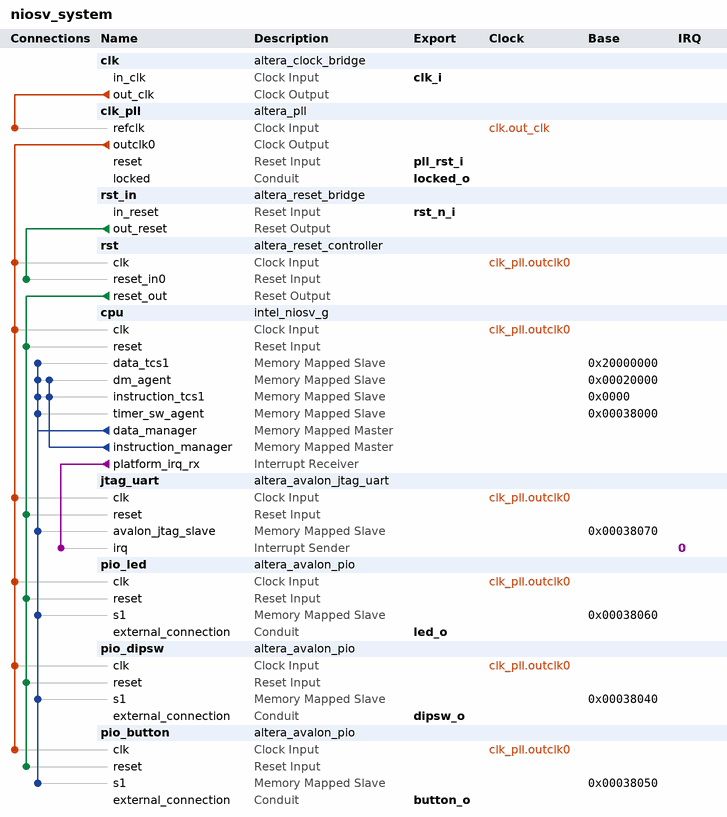
[diagram p0: system contents]
# Platform Designer (Qsys) system niosv_system, Cyclone V 5CSEMA6U23I7
# Parameters at their usual value, and those the tool derives, are not listed.
package require -exact qsys 25.1
create_system niosv_system
set_project_property DEVICE_FAMILY {Cyclone V}
set_project_property DEVICE 5CSEMA6U23I7

add_instance clk altera_clock_bridge 25.1
set_instance_parameter_value clk DERIVED_CLOCK_RATE 0
set_instance_parameter_value clk EXPLICIT_CLOCK_RATE 50000000

add_instance clk_pll altera_pll 25.1
set_instance_parameter_value clk_pll gui_device_speed_grade 1
set_instance_parameter_value clk_pll gui_number_of_clocks 1
set_instance_parameter_value clk_pll gui_operation_mode direct
set_instance_parameter_value clk_pll gui_output_clock_frequency0 100.0
set_instance_parameter_value clk_pll gui_pll_mode {Integer-N PLL}
set_instance_parameter_value clk_pll gui_reference_clock_frequency 50.0
set_instance_parameter_value clk_pll gui_use_locked true

add_instance rst_in altera_reset_bridge 25.1
set_instance_parameter_value rst_in ACTIVE_LOW_RESET 1
set_instance_parameter_value rst_in SYNCHRONOUS_EDGES none

add_instance rst altera_reset_controller 25.1
set_instance_parameter_value rst NUM_RESET_INPUTS 1
set_instance_parameter_value rst SYNC_DEPTH 2

add_instance cpu intel_niosv_g 4.0.0
set_instance_parameter_value cpu Blind_Window_Period 1000
set_instance_parameter_value cpu CLICenabledInterruptMode 0
set_instance_parameter_value cpu CLICenabledShadowRegisterFiles 1
set_instance_parameter_value cpu Default_Timeout_Period 255
set_instance_parameter_value cpu alignCLICVectorTable 8
set_instance_parameter_value cpu basicInterruptMode 0
set_instance_parameter_value cpu basicShadowRegisterFiles 0
set_instance_parameter_value cpu clockFrequency 100000000
set_instance_parameter_value cpu dataCacheSize 0
set_instance_parameter_value cpu disableFsqrtFdiv false
set_instance_parameter_value cpu dtcm1Base 536870912
set_instance_parameter_value cpu dtcm1InitFile ../software/build/firmware/niosvdtcm1.hex
set_instance_parameter_value cpu dtcm1Size 32768
set_instance_parameter_value cpu dtcm2Base 0
set_instance_parameter_value cpu dtcm2Size 0
set_instance_parameter_value cpu enableBranchPrediction true
set_instance_parameter_value cpu enableCLICInterruptEdgeTriggerConfig false
set_instance_parameter_value cpu enableCLICInterruptPolarityConfig false
set_instance_parameter_value cpu enableCLICSelectiveHardwareVectoring false
set_instance_parameter_value cpu enableCoreLevelInterruptController false
set_instance_parameter_value cpu enableDebug true
set_instance_parameter_value cpu enableDebugReset false
set_instance_parameter_value cpu enableECCFull false
set_instance_parameter_value cpu enableECCLite false
set_instance_parameter_value cpu enableFPU false
set_instance_parameter_value cpu enableLockstep false
set_instance_parameter_value cpu enableLockstepExtRst false
set_instance_parameter_value cpu enableMulDiv true
set_instance_parameter_value cpu hartId 0
set_instance_parameter_value cpu instCacheSize 0
set_instance_parameter_value cpu itcm1Base 0
set_instance_parameter_value cpu itcm1InitFile ../software/build/firmware/niosvitcm1.hex
set_instance_parameter_value cpu itcm1Size 131072
set_instance_parameter_value cpu itcm2Base 0
set_instance_parameter_value cpu itcm2Size 0
set_instance_parameter_value cpu numCLICDebugTriggers 0
set_instance_parameter_value cpu numCLICLevels 2
set_instance_parameter_value cpu numCLICPlatformInterrupts 16
set_instance_parameter_value cpu numCLICPriorities 8
set_instance_parameter_value cpu peripheralRegionABase 0
set_instance_parameter_value cpu peripheralRegionASize 0
set_instance_parameter_value cpu peripheralRegionBBase 0
set_instance_parameter_value cpu peripheralRegionBSize 0
set_instance_parameter_value cpu resetOffset 0
set_instance_parameter_value cpu resetSlave Absolute
set_instance_parameter_value cpu useResetReq false

add_instance jtag_uart altera_avalon_jtag_uart 25.1
set_instance_parameter_value jtag_uart readBufferDepth 1024
set_instance_parameter_value jtag_uart simInteractiveOptions NO_INTERACTIVE_WINDOWS
set_instance_parameter_value jtag_uart writeBufferDepth 1024

add_instance pio_led altera_avalon_pio 25.1
set_instance_parameter_value pio_led direction Output
set_instance_parameter_value pio_led width 1

add_instance pio_dipsw altera_avalon_pio 25.1
set_instance_parameter_value pio_dipsw direction Input
set_instance_parameter_value pio_dipsw width 4

add_instance pio_button altera_avalon_pio 25.1
set_instance_parameter_value pio_button direction Input
set_instance_parameter_value pio_button width 2

# connections
add_connection clk.out_clk clk_pll.refclk clock
add_connection clk_pll.outclk0 cpu.clk clock
add_connection clk_pll.outclk0 jtag_uart.clk clock
add_connection clk_pll.outclk0 pio_button.clk clock
add_connection clk_pll.outclk0 pio_dipsw.clk clock
add_connection clk_pll.outclk0 pio_led.clk clock
add_connection clk_pll.outclk0 rst.clk clock
add_connection rst.reset_out cpu.reset reset
add_connection rst.reset_out jtag_uart.reset reset
add_connection rst.reset_out pio_button.reset reset
add_connection rst.reset_out pio_dipsw.reset reset
add_connection rst.reset_out pio_led.reset reset
add_connection rst_in.out_reset rst.reset_in0 reset
add_connection cpu.data_manager cpu.data_tcs1 avalon
set_connection_parameter_value cpu.data_manager/cpu.data_tcs1 baseAddress 0x20000000
add_connection cpu.data_manager cpu.dm_agent avalon
set_connection_parameter_value cpu.data_manager/cpu.dm_agent baseAddress 0x00020000
add_connection cpu.data_manager cpu.instruction_tcs1 avalon
set_connection_parameter_value cpu.data_manager/cpu.instruction_tcs1 baseAddress 0x0000
add_connection cpu.data_manager cpu.timer_sw_agent avalon
set_connection_parameter_value cpu.data_manager/cpu.timer_sw_agent baseAddress 0x00038000
add_connection cpu.data_manager jtag_uart.avalon_jtag_slave avalon
set_connection_parameter_value cpu.data_manager/jtag_uart.avalon_jtag_slave baseAddress 0x00038070
add_connection cpu.data_manager pio_button.s1 avalon
set_connection_parameter_value cpu.data_manager/pio_button.s1 baseAddress 0x00038050
add_connection cpu.data_manager pio_dipsw.s1 avalon
set_connection_parameter_value cpu.data_manager/pio_dipsw.s1 baseAddress 0x00038040
add_connection cpu.data_manager pio_led.s1 avalon
set_connection_parameter_value cpu.data_manager/pio_led.s1 baseAddress 0x00038060
add_connection cpu.instruction_manager cpu.dm_agent avalon
set_connection_parameter_value cpu.instruction_manager/cpu.dm_agent baseAddress 0x00020000
add_connection cpu.instruction_manager cpu.instruction_tcs1 avalon
set_connection_parameter_value cpu.instruction_manager/cpu.instruction_tcs1 baseAddress 0x0000
add_connection cpu.platform_irq_rx jtag_uart.irq interrupt
set_connection_parameter_value cpu.platform_irq_rx/jtag_uart.irq irqNumber 0

# exported interfaces
add_interface button_o conduit end
set_interface_property button_o EXPORT_OF pio_button.external_connection
add_interface clk_i clock sink
set_interface_property clk_i EXPORT_OF clk.in_clk
add_interface dipsw_o conduit end
set_interface_property dipsw_o EXPORT_OF pio_dipsw.external_connection
add_interface led_o conduit end
set_interface_property led_o EXPORT_OF pio_led.external_connection
add_interface locked_o conduit end
set_interface_property locked_o EXPORT_OF clk_pll.locked
add_interface pll_rst_i reset sink
set_interface_property pll_rst_i EXPORT_OF clk_pll.reset
add_interface rst_n_i reset sink
set_interface_property rst_n_i EXPORT_OF rst_in.in_reset

set_interconnect_requirement {$system} qsys_mm.clockCrossingAdapter HANDSHAKE
set_interconnect_requirement {$system} qsys_mm.enableEccProtection FALSE
set_interconnect_requirement {$system} qsys_mm.insertDefaultSlave FALSE
set_interconnect_requirement {$system} qsys_mm.maxAdditionalLatency 1

save_system niosv_system.qsys
